# Altium schematic sheet SerialInterface.SchDoc: =ProjectTitle
size B; Engineer: H. Collector; Organization: IMR Engineering; Address1: 3621 Gin Way; Address2: Snellville, GA 30039; Address3: USA; SheetNumber: 6; SheetTotal: 10
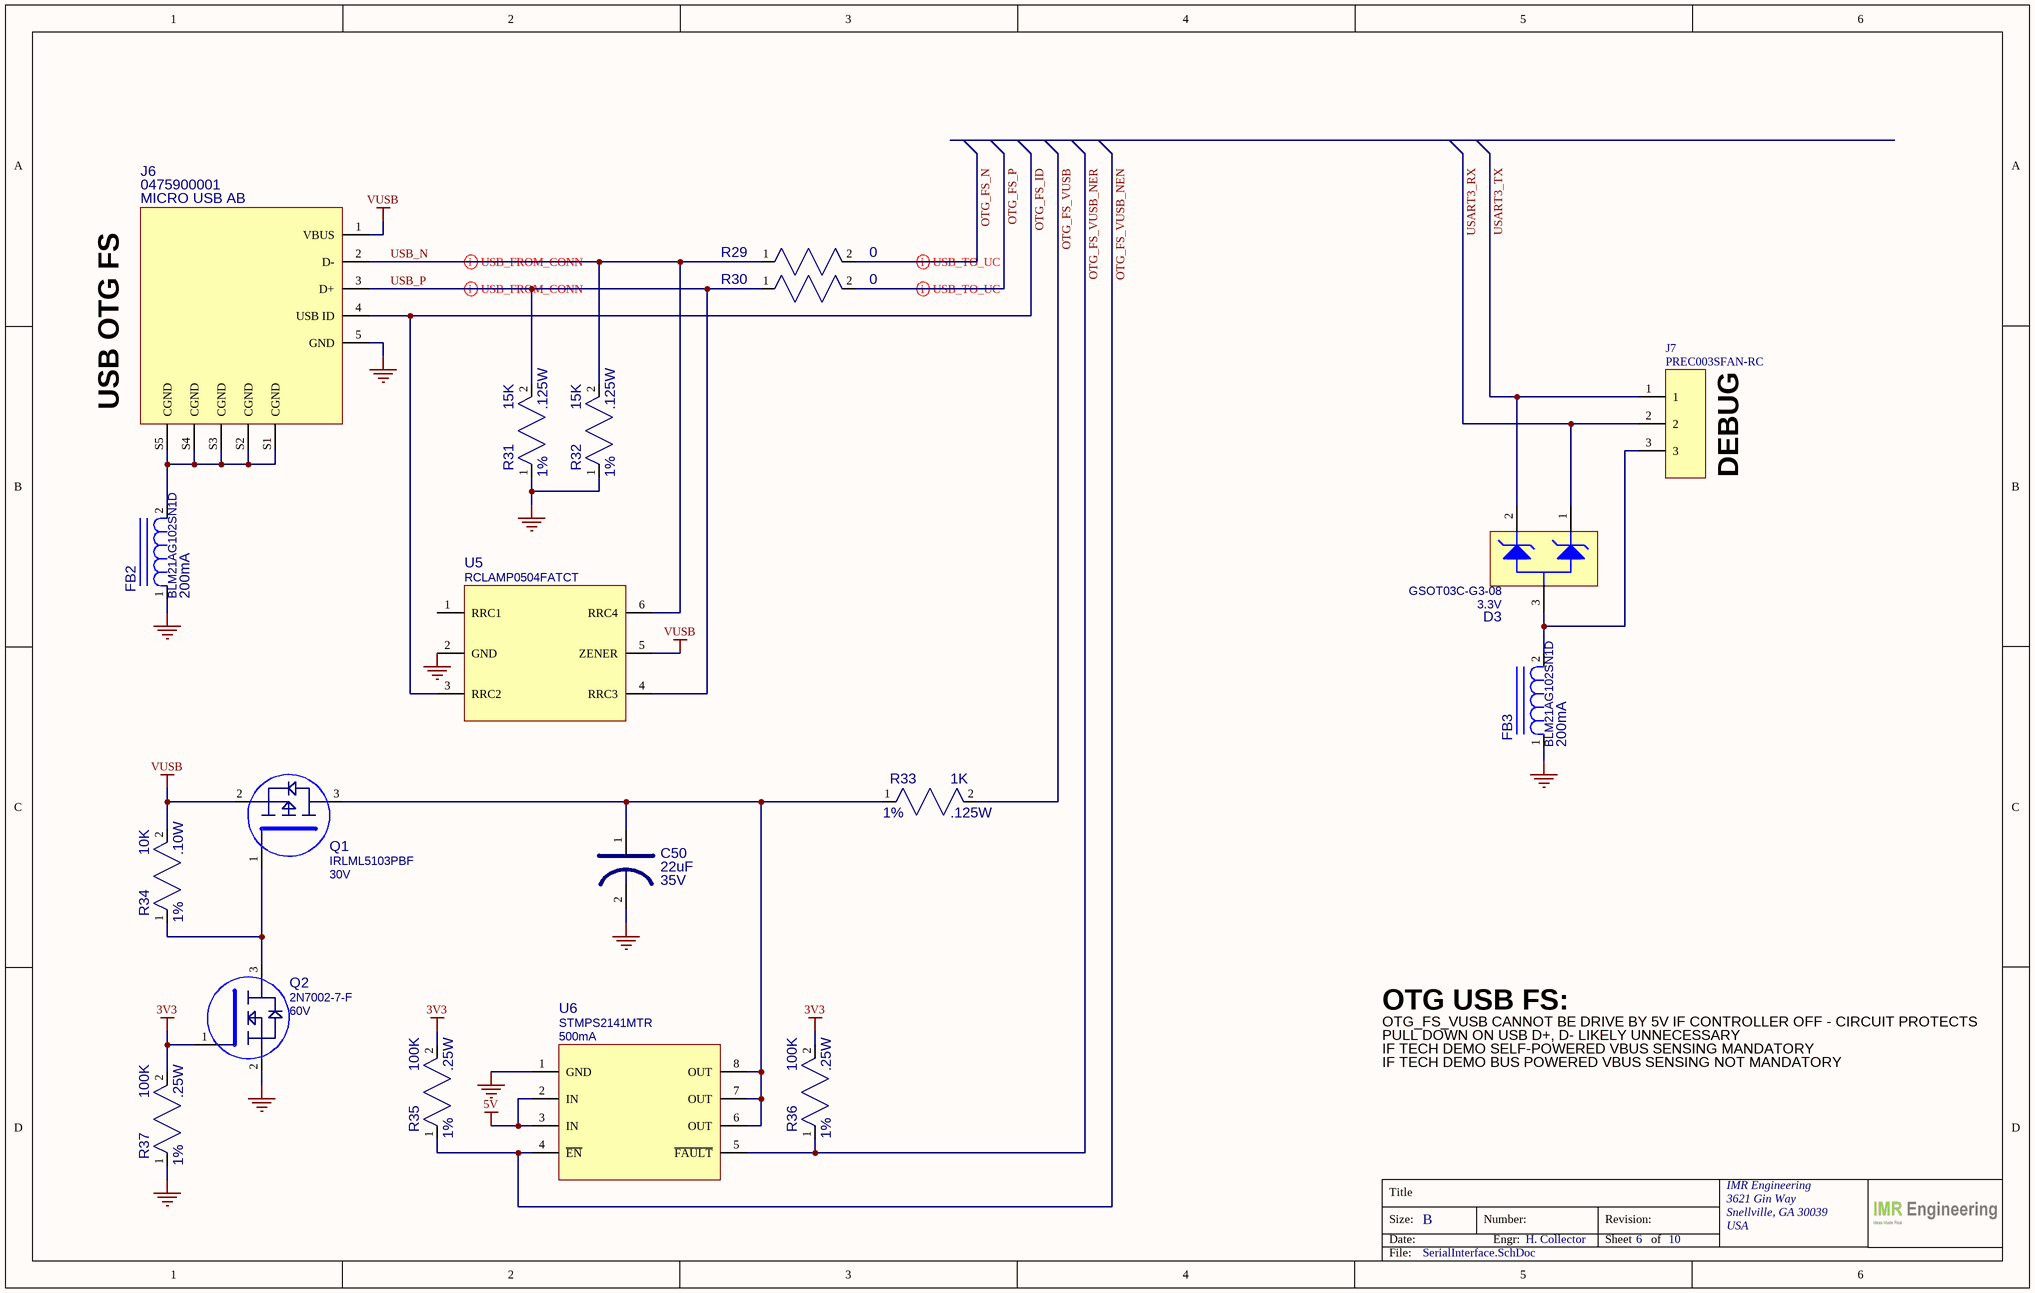
[diagram p0: SerialInterface.SchDoc]

## Parts
C50  value 22uF  VOLTAGE: 35V  [CAP_ALE_SMD_6.6x6.6]  (hidden comment: UZS1C220MCL1GB)
D3  value 3.3V  [SOT-23]  (hidden comment: GSOT03C-G3-08)
FB2  value 200mA  [RES_0805]  (hidden comment: BLM21AG102SN1D)
FB3  value 200mA  [RES_0805]  (hidden comment: BLM21AG102SN1D)
J6  value MICRO USB AB  [MICRO_USB_AB_MOLEX_0475900001]  (hidden comment: 0475900001)
J7  PREC003SFAN-RC  [HDR_1X3_100MILL]
Q1  value 30V  [SOT-23]  (hidden comment: IRLML5103PBF)
Q2  value 60V  [SOT-23]  (hidden comment: 2N7002-7-F)
R29  value 0  [PMG_RES_0805]  (hidden comment: RC0805JR-070RL)
R30  value 0  [PMG_RES_0805]  (hidden comment: RC0805JR-070RL)
R31  value 15K  TOLERANCE: 1%  POWER: .125W  [RES_0805]  (hidden comment: RC0805FR-0715KL)
R32  value 15K  TOLERANCE: 1%  POWER: .125W  [RES_0805]  (hidden comment: RC0805FR-0715KL)
R33  value 1K  TOLERANCE: 1%  POWER: .125W  [RES_0805]  (hidden comment: RC0805FR-071KL)
R34  value 10K  TOLERANCE: 1%  POWER: .10W  [RES_0603]  (hidden comment: RC0603FR-0710KL)
R35  value 100K  TOLERANCE: 1%  POWER: .25W  [PMG_RES_0805]  (hidden comment: RK73H2ATTD1003F)
R36  value 100K  TOLERANCE: 1%  POWER: .25W  [PMG_RES_0805]  (hidden comment: RK73H2ATTD1003F)
R37  value 100K  TOLERANCE: 1%  POWER: .25W  [PMG_RES_0805]  (hidden comment: RK73H2ATTD1003F)
U5  RCLAMP0504FATCT  [SOT-363_6-TSSOP_SC-88]
U6  value 500mA  [SO-8]  (hidden comment: STMPS2141MTR)

## Nets
3V3: Q2.1(B) R35.2 R36.2 R37.2
5V: U6.2(IN) U6.3(IN)
GND: C50.2 FB2.1 FB3.1 J6.5(GND) Q2.2(E) R31.1 R32.1 R37.1 U5.2(GND) U6.1(GND)
VUSB: J6.1(VBUS) Q1.2(E) R34.2 U5.5(ZENER)
OTG_FS_ID: J6.4(USB_ID) U5.3(RRC2)
OTG_FS_N: R29.2
OTG_FS_P: R30.2
OTG_FS_VUSB: R33.2
OTG_FS_VUSB_NEN: R35.1 U6.4(~{EN})
OTG_FS_VUSB_NER: R36.1 U6.5(~{FAULT})
USART3_RX: D3.1(A1) J7.2
USART3_TX: D3.2(A2) J7.1
USB_N: J6.2(D-) R29.1 R32.2 U5.6(RRC4)
USB_P: J6.3(D+) R30.1 R31.2 U5.4(RRC3)
NetC50_1: C50.1 Q1.3(C) R33.1 U6.6(OUT) U6.7(OUT) U6.8(OUT)
NetD3_3: D3.3(A) FB3.2 J7.3
NetFB2_2: FB2.2 J6.S1(CGND) J6.S2(CGND) J6.S3(CGND) J6.S4(CGND) J6.S5(CGND)
NetQ1_1: Q1.1(B) Q2.3(C) R34.1

Not connected (* = marked no-connect by the designer): U5 1(RRC1)

## Layout directives
differential pair: OTG_FS_N, OTG_FS_P, USB_N, USB_P

## Notes on the sheet
- (near J6) USB OTG FS
- (near J7) DEBUG
- OTG USB FS:
- OTG_FS_VUSB CANNOT BE DRIVE BY 5V IF CONTROLLER OFF - CIRCUIT PROTECTS
- PULL DOWN ON USB D+, D- LIKELY UNNECESSARY
- IF TECH DEMO SELF-POWERED VBUS SENSING MANDATORY
- IF TECH DEMO BUS POWERED VBUS SENSING NOT MANDATORY
- Title
- Size:
- Date:
- B
- Number:
- Engr:
- Revision:
- Sheet
- of
- File:

## Library data of the parts
C50 = CAP_22UF_35V_ALE_NF: CAP, AL E, 22UF, 35V, 20%, ROHS; MFG: NICHICON; MFG_PN: UZS1C220MCL1GB; TOLERANCE: 20%; Supplier 1: Digi-Key; Supplier Part Number 1: 493-10138-1-ND
D3 = DIODE_TVS_GSOT03C-G3-08: TVS DIODE 3.3V 12.3V SOT23; MFG: Vishay Semiconductor; POWER: 30A (8/20us); Case/Package: SOT-23; Supplier 1: Digi-Key; Supplier Part Number 1: GSOT03C-G3-08GICT-ND; MFG_PN: GSOT03C-G3-08; ClassName: Serial_DebugPort
FB2 FB3 = FERRITE_BLM21AG102SN1D: FERRITE, 1KOHM AT 100MHZ, 220MA, .450DCR; MFG: MURATA; TOLERANCE: 10%; Supplier 1: Digi-Key; Supplier Part Number 1: 490-1041-1-ND; MFG_PN: BLM21AG102SN1D
  FB2: ClassName: Serial_USB_FS
  FB3: ClassName: Serial_DebugPort
J6 = CONN_USB_MOLEX_0475900001: CONN RCPT MICRO USB AB 5P SMD RA; MFG: Molex; Supplier 1: Digi-Key; Supplier Part Number 1: WM17144CT-ND; MFG_PN: 0475900001; ClassName: Serial_USB_FS
J7 = CONN_3P_SINGLE_ROW: CONN HEADER VERT 3POS 2.54MM; MFG: Sullins Connector Solutions; Case/Package: 3P_2.54MM; MFG_PN: PREC003SFAN-RC; Supplier 1: Digi-Key; Supplier Part Number 1: S1212EC-03-ND; Value: *; ClassName: Serial_DebugPort
Q1 = MOSFET_PCH_IRLML5103PBF: MOSFET P CHN, VDS=30V, RDSON = .6OHM, SOT 23; MFG: INTERNATIONAL RECTIFIER; ComponentLink1Description: Manufacturer Link; ComponentLink1URL: http://www.fairchildsemi.com/; ComponentLink2Description: Datasheet; ComponentLink2URL: http://www.fairchildsemi.com/ds/2N%2F2N3904.pdf; Supplier 1: Digi-Key; MFG_PN: IRLML5103PBF; Supplier Part Number 1: IRLML5103PBFCT-ND; ClassName: Serial_USB_FS
Q2 = MOSFET_NCH_2N7002-7-F: MOSFET N-CH 60V 115MA SOT23-3; MFG: Diodes Incorporated; Case/Package: SOT-23; Supplier 1: Digi-Key; Supplier Part Number 1: 2N7002-FDICT-ND; MFG_PN: 2N7002-7-F; ClassName: Serial_USB_FS
R29 R30 = RES_0_0805_1/8W: RES SMD 0 OHM JUMPER 1/8W 0805; MFG: Yageo; POWER: .125W; Case/Package: 0805; MFG_PN: RC0805JR-070RL; Supplier 1: Digi-Key; Supplier Part Number 1: 311-0.0ARCT-ND; TOLERANCE: JUMPER; ClassName: Serial_USB_FS
R31 R32 = RES_15K_0805_1/8W_1%: RES SMD 15K OHM 1% 1/8W 0805; MFG: Yageo; Case/Package: 0805; MFG_PN: RC0805FR-0715KL; Supplier 1: Digi-Key; Supplier Part Number 1: 311-15.0KCRCT-ND; ClassName: Serial_USB_FS
R33 = RES_1K_0805_1/8W_1%: RES SMD 1K OHM 1% 1/8W 0805; MFG: Yageo; Case/Package: 0805; MFG_PN: RC0805FR-071KL; Supplier 1: Digi-Key; Supplier Part Number 1: 311-1.00KCRCT-ND; ClassName: Serial_USB_FS
R34 = RES_10K_0603_1/10W_1%: RES SMD 10K OHM 1% 1/10W 0603; MFG: Yageo; Case/Package: 0603; MFG_PN: RC0603FR-0710KL; Supplier 1: Digi-Key; Supplier Part Number 1: 311-10.0KHRCT-ND; ClassName: Serial_USB_FS
R35-R37 = RES_100K_0805_1/4W_1%: RES SMD 100K OHM 1% 1/4W 0805; MFG: KOA Speer Electronics, Inc.; Case/Package: 0805; MFG_PN: RK73H2ATTD1003F; Supplier 1: Digi-Key; Supplier Part Number 1: 2019-RK73H2ATTD1003FCT-ND; ClassName: Serial_USB_FS
U5 = IC_RCLAMP0504FATCT: TVS DIODE 5V 25V SC70-6; MFG: Semtech Corporation; Supplier 1: Digi-Key; Supplier Part Number 1: RCLAMP0504FATCTCT-ND; VALUE: 5V; MFG_PN: RCLAMP0504FATCT; ClassName: Serial_USB_FS
U6 = IC_STMPS2141MTR: IC PWR SWITCH N-CHANNEL 1:1 8SO; MFG: STMicroelectronics; Supplier 1: Digi-Key; Supplier Part Number 1: 497-6932-1-ND; Case/Package: SO8; MFG_PN: STMPS2141MTR; ClassName: Serial_USB_FS